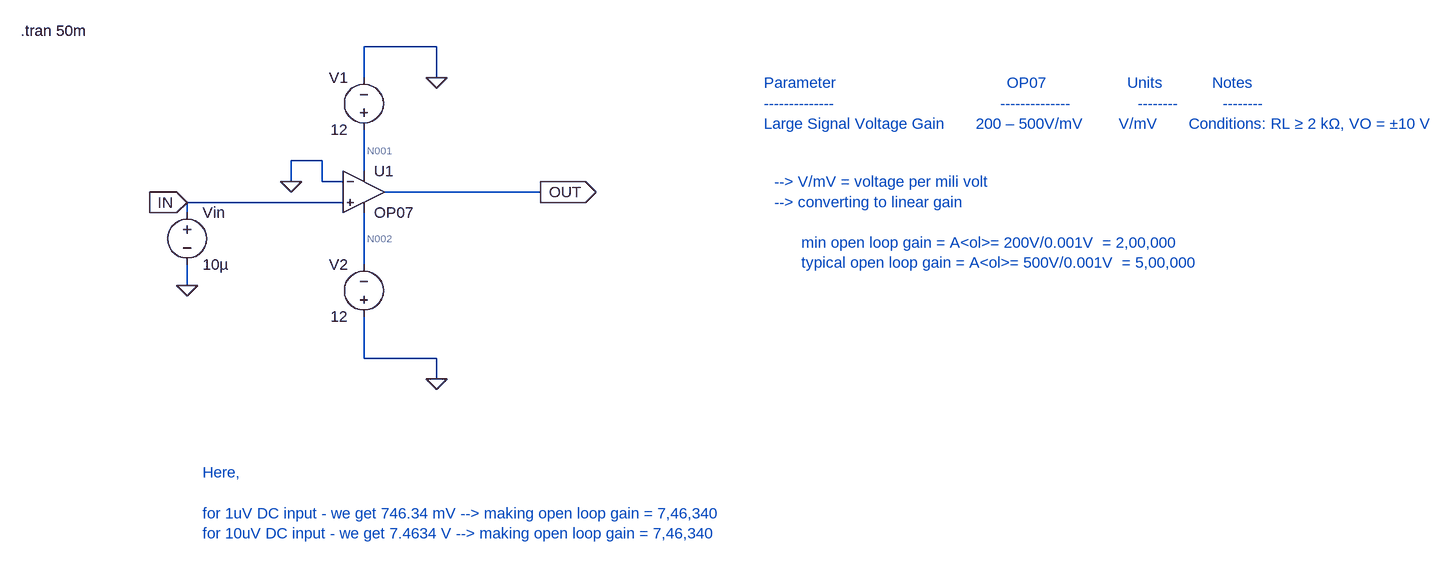
[diagram p0: schematic Open_loop_amplifier_for_DC_input.asc]
Open_loop_amplifier_for_DC_input.asc, the LTspice schematic file:
Version 4.1
SHEET 1 1980 680
WIRE 192 -144 80 -144
WIRE 80 -96 80 -144
WIRE 192 -96 192 -144
WIRE 16 32 -32 32
WIRE 80 48 80 -16
WIRE -32 64 -32 32
WIRE 16 64 16 32
WIRE 48 64 16 64
WIRE 352 80 112 80
WIRE 48 96 -192 96
WIRE -192 112 -192 96
WIRE 80 192 80 112
WIRE -192 224 -192 192
WIRE 80 336 80 272
WIRE 192 336 80 336
WIRE 192 368 192 336
FLAG 192 -96 0
FLAG 192 368 0
FLAG -192 224 0
FLAG -32 64 0
FLAG -192 96 IN
IOPIN -192 96 In
FLAG 352 80 OUT
IOPIN 352 80 Out
SYMBOL voltage 80 0 R180
WINDOW 0 24 96 Left 2
WINDOW 3 24 16 Left 2
WINDOW 123 0 0 Left 0
WINDOW 39 0 0 Left 0
SYMATTR InstName V1
SYMATTR Value 12
SYMBOL voltage -192 96 R0
WINDOW 123 0 0 Left 0
WINDOW 39 0 0 Left 0
SYMATTR InstName Vin
SYMATTR Value 10µ
SYMBOL voltage 80 288 R180
WINDOW 0 24 96 Left 2
WINDOW 3 24 16 Left 2
WINDOW 123 0 0 Left 0
WINDOW 39 0 0 Left 0
SYMATTR InstName V2
SYMATTR Value 12
SYMBOL OpAmps\\OP07 80 16 R0
SYMATTR InstName U1
TEXT 696 -88 Left 2 ;Parameter                                      OP07                  Units           Notes\n--------------                                     --------------               --------          --------\nLarge Signal Voltage Gain       200 – 500V/mV        V/mV       Conditions: RL ≥ 2 kΩ, VO = ±10 V
TEXT 712 64 Left 2 ;--> V/mV = voltage per mili volt\n--> converting to linear gain\n \n      min open loop gain = A<ol>= 200V/0.001V  = 2,00,000\n      typical open loop gain = A<ol>= 500V/0.001V  = 5,00,000
TEXT -448 -168 Left 2 !.tran 50m
TEXT -168 512 Left 2 ;Here,\n \nfor 1uV DC input - we get 746.34 mV --> making open loop gain = 7,46,340\nfor 10uV DC input - we get 7.4634 V --> making open loop gain = 7,46,340

The netlist it stands for:
* Open_loop_amplifier_for_DC_input.asc
V1 N001 0 12
Vin IN 0 10µ
V2 0 N002 12
X§U1 IN 0 N001 N002 OUT LT1001  ; OP07, pins In+ In- V+ V- OUT
* Parameter                                      OP07                  Units           Notes
* --------------                                     --------------               --------          --------
* Large Signal Voltage Gain       200 – 500V/mV        V/mV       Conditions: RL ≥ 2 kΩ, VO = ±10 V
* --> V/mV = voltage per mili volt
* --> converting to linear gain
*       min open loop gain = A<ol>= 200V/0.001V  = 2,00,000
*       typical open loop gain = A<ol>= 500V/0.001V  = 5,00,000
.tran 50m
* Here,
* for 1uV DC input - we get 746.34 mV --> making open loop gain = 7,46,340
* for 10uV DC input - we get 7.4634 V --> making open loop gain = 7,46,340
.lib LTC.lib
.backanno
.end

* Results of the author's LTspice run, read from the files saved beside the schematic
* Operating Point, zero values left out:
*   V(in) = 10 µV
*   V(out) = 7.463 V
*   V(n001) = 12 V
*   V(n002) = -12 V
*   I(V1) = -2.25 mA
*   I(V2) = -2.25 mA
*   Ix(u1:3) = 2.25 mA
*   Ix(u1:4) = -2.25 mA
*   Ix(u1:5) = -14.93 pA